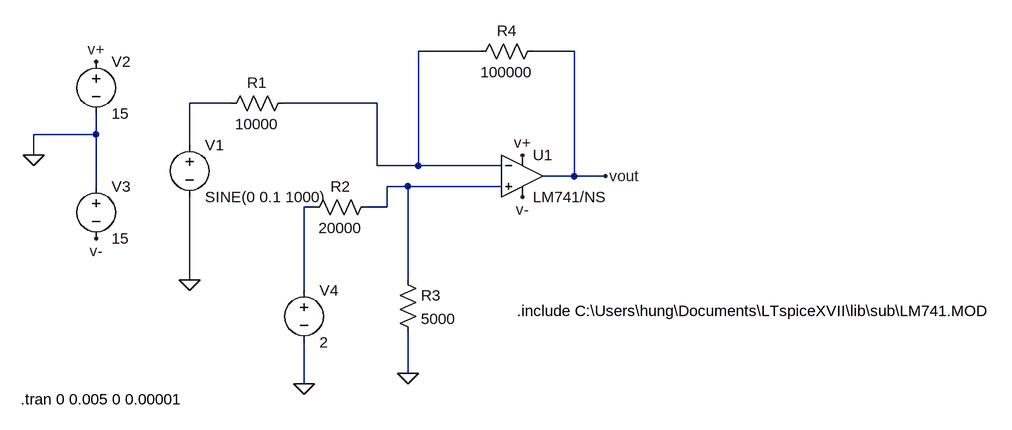
[diagram p0: schematic part 4b.asc]
part 4b.asc, the LTspice schematic file:
Version 4
SHEET 1 1356 680
WIRE 480 0 384 0
WIRE 624 0 560 0
WIRE 96 80 32 80
WIRE 320 80 176 80
WIRE -112 128 -112 96
WIRE -112 128 -208 128
WIRE 32 144 32 80
WIRE -208 160 -208 128
WIRE 320 176 320 80
WIRE 384 176 384 0
WIRE 384 176 320 176
WIRE 512 176 384 176
WIRE 624 192 624 0
WIRE 624 192 576 192
WIRE 672 192 624 192
WIRE -112 208 -112 128
WIRE 368 208 336 208
WIRE 512 208 368 208
WIRE 224 240 208 240
WIRE 336 240 336 208
WIRE 336 240 304 240
WIRE 32 352 32 224
WIRE 368 352 368 208
WIRE 208 368 208 240
WIRE 368 496 368 432
WIRE 208 512 208 448
FLAG -208 160 0
FLAG 32 352 0
FLAG 208 512 0
FLAG 368 496 0
FLAG -112 288 v-
FLAG 544 224 v-
FLAG -112 16 v+
FLAG 544 160 v+
FLAG 672 192 vout
SYMBOL voltage 32 128 R0
WINDOW 123 0 0 Left 0
WINDOW 39 0 0 Left 0
SYMATTR InstName V1
SYMATTR Value SINE(0 0.1 1000)
SYMBOL voltage -112 0 R0
WINDOW 123 0 0 Left 0
WINDOW 39 0 0 Left 0
SYMATTR InstName V2
SYMATTR Value 15
SYMBOL voltage -112 192 R0
WINDOW 123 0 0 Left 0
WINDOW 39 0 0 Left 0
SYMATTR InstName V3
SYMATTR Value 15
SYMBOL voltage 208 352 R0
WINDOW 123 0 0 Left 0
WINDOW 39 0 0 Left 0
SYMATTR InstName V4
SYMATTR Value 2
SYMBOL res 320 224 R90
WINDOW 0 0 56 VBottom 2
WINDOW 3 32 56 VTop 2
SYMATTR InstName R2
SYMATTR Value 20000
SYMBOL res 192 64 R90
WINDOW 0 0 56 VBottom 2
WINDOW 3 32 56 VTop 2
SYMATTR InstName R1
SYMATTR Value 10000
SYMBOL Opamps\\opamp2 544 128 R0
SYMATTR InstName U1
SYMATTR Value LM741/NS
SYMBOL res 352 336 R0
SYMATTR InstName R3
SYMATTR Value 5000
SYMBOL res 576 -16 R90
WINDOW 0 0 56 VBottom 2
WINDOW 3 32 56 VTop 2
SYMATTR InstName R4
SYMATTR Value 100000
TEXT -228 536 Left 2 !.tran 0 0.005 0 0.00001
TEXT 536 400 Left 2 !.include C:\\Users\\hung\\Documents\\LTspiceXVII\\lib\\sub\\LM741.MOD

The netlist it stands for:
* part 4b.asc
V1 N002 0 SINE(0 0.1 1000)
V2 v+ 0 15
V3 0 v- 15
V4 N004 0 2
R2 N003 N004 20000
R1 N001 N002 10000
XU1 N003 N001 v+ v- vout LM741/NS  ; pins In+ In- V+ V- OUT
R3 N003 0 5000
R4 vout N001 100000
.tran 0 0.005 0 0.00001
.include C:\Users\hung\Documents\LTspiceXVII\lib\sub\LM741.MOD
.backanno
.end